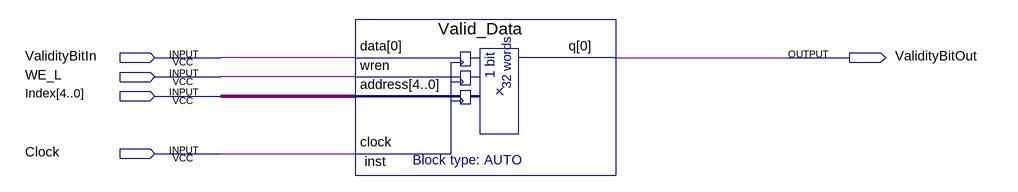
[diagram p0: schematic sheet]
// Quartus schematic Valid.bdf as structural Verilog: 1 symbols, 5 pins
module Valid (
  input  ValidityBitIn,
  input  WE_L,
  input  [4:0] Index,
  input  Clock,
  output ValidityBitOut
);

  Valid_Data inst (.data(ValidityBitIn), .wren(WE_L), .address(Index), .clock(Clock), .q(ValidityBitOut));
endmodule
